# Altium schematic sheet Sheet3_MCU_PSU.SchDoc
size A4; DocumentNumber: 3; SheetNumber: 3; SheetTotal: 3
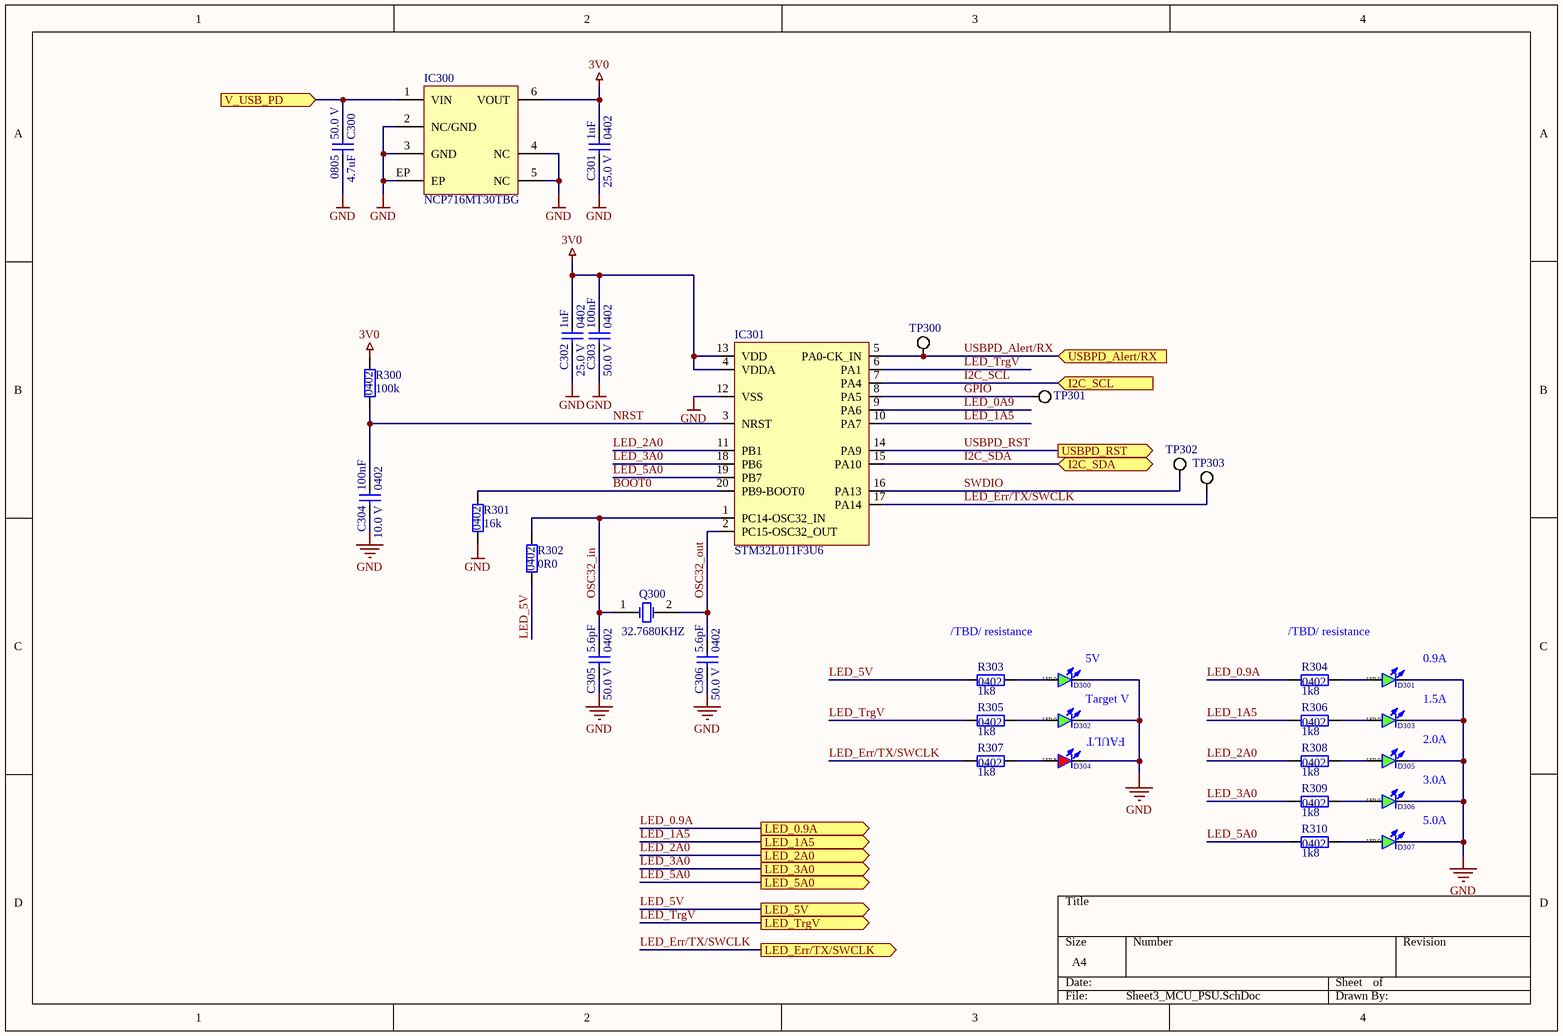
[diagram p0: Sheet3_MCU_PSU.SchDoc]

## Parts
C300  Capacitance: 4.7uF  Footprint: 0805  Voltage: 50.0 V  [C_0805]  (hidden comment: C 4.7uF 0805 50V)
C301  Capacitance: 1uF  Footprint: 0402  Voltage: 25.0 V  [C_0402]  (hidden comment: C 1uF 0402 25V)
C302  Capacitance: 1uF  Footprint: 0402  Voltage: 25.0 V  [C_0402]  (hidden comment: C 1uF 0402 25V)
C303  Capacitance: 100nF  Footprint: 0402  Voltage: 50.0 V  [C_0402]  (hidden comment: C 100nF 0402 50V)
C304  Capacitance: 100nF  Footprint: 0402  Voltage: 10.0 V  [C_0402]  (hidden comment: C 100nF 0402 10V)
C305  Capacitance: 5.6pF  Footprint: 0402  Voltage: 50.0 V  [C_0402]  (hidden comment: C 5.6pF 0402 50V)
C306  Capacitance: 5.6pF  Footprint: 0402  Voltage: 50.0 V  [C_0402]  (hidden comment: C 5.6pF 0402 50V)
D300  LED G  [LED_0603]
D301  LED G  [LED_0603]
D302  LED G  [LED_0603]
D303  LED G  [LED_0603]
D304  LED R  [LED_0603]
D305  LED G  [LED_0603]
D306  LED G  [LED_0603]
D307  LED G  [LED_0603]
IC300  NCP716MT30TBG  [WDFN-6_EP]
IC301  STM32L011F3U6  [UFQFN-20]
Q300  32.7680KHZ  [Q2_3.2x1.5]
R300  Resistance: 100k  Footprint: 0402  [R_0402]  (hidden comment: R 100k 0402)
R301  Resistance: 16k  Footprint: 0402  [R_0402]  (hidden comment: R 16k 0402)
R302  Resistance: 0R0  Footprint: 0402  [R_0402]  (hidden comment: R 0R0 0402)
R303  Resistance: 1k8  Footprint: 0402  [R_0402]  (hidden comment: R 1k8 0402)
R304  Resistance: 1k8  Footprint: 0402  [R_0402]  (hidden comment: R 1k8 0402)
R305  Resistance: 1k8  Footprint: 0402  [R_0402]  (hidden comment: R 1k8 0402)
R306  Resistance: 1k8  Footprint: 0402  [R_0402]  (hidden comment: R 1k8 0402)
R307  Resistance: 1k8  Footprint: 0402  [R_0402]  (hidden comment: R 1k8 0402)
R308  Resistance: 1k8  Footprint: 0402  [R_0402]  (hidden comment: R 1k8 0402)
R309  Resistance: 1k8  Footprint: 0402  [R_0402]  (hidden comment: R 1k8 0402)
R310  Resistance: 1k8  Footprint: 0402  [R_0402]  (hidden comment: R 1k8 0402)
TP300  TP  [TP_1mm]  (value not drawn)  (net tie, no BOM)
TP301  TP  [TP_1mm]  (value not drawn)  (net tie, no BOM)
TP302  TP  [TP_1mm]  (value not drawn)  (net tie, no BOM)
TP303  TP  [TP_1mm]  (value not drawn)  (net tie, no BOM)

## Ports
I2C_SCL (in), I2C_SDA (bidir), LED_0.9A (out), LED_1A5 (out), LED_2A0 (out), LED_3A0 (out), LED_5A0 (out), LED_5V (out), LED_Err/TX/SWCLK (out), LED_TrgV (out), USBPD_Alert/RX (in), USBPD_RST (out), V_USB_PD (in)

## Nets
3V0: C301.2 C302.2 C303.2 IC300.6(VOUT) IC301.4(VDDA) IC301.13(VDD) R300.2
GND: C300.2 C301.1 C302.1 C303.1 C304.1 C305.1 C306.1 D300.K D301.K D302.K D303.K D304.K D305.K D306.K D307.K IC300.2(NC/GND) IC300.3(GND) IC300.4(NC) IC300.5(NC) IC300.EP IC301.12(VSS) R301.1
BOOT0: IC301.20(PB9-BOOT0) R301.2
GPIO: IC301.8(PA5) TP301.1(TP)
I2C_SCL: IC301.7(PA4) ; port I2C_SCL
I2C_SDA: IC301.15(PA10) ; port I2C_SDA
LED_0.9A: R304.2 ; port LED_0.9A
LED_0A9: IC301.9(PA6)
LED_1A5: IC301.10(PA7) R306.2 ; port LED_1A5
LED_2A0: IC301.11(PB1) R308.2 ; port LED_2A0
LED_3A0: IC301.18(PB6) R309.2 ; port LED_3A0
LED_5A0: IC301.19(PB7) R310.2 ; port LED_5A0
LED_5V: R302.1 R303.2 ; port LED_5V
LED_Err/TX/SWCLK: IC301.17(PA14) R307.2 TP303.1(TP) ; port LED_Err/TX/SWCLK
LED_TrgV: IC301.6(PA1) R305.2 ; port LED_TrgV
NRST: C304.2 IC301.3(NRST) R300.1
OSC32_in: C305.2 IC301.1(PC14-OSC32_IN) Q300.1(OSC1) R302.2
OSC32_out: C306.2 IC301.2(PC15-OSC32_OUT) Q300.2(OSC2)
SWDIO: IC301.16(PA13) TP302.1(TP)
USBPD_Alert/RX: IC301.5(PA0-CK_IN) TP300.1(TP) ; port USBPD_Alert/RX
USBPD_RST: IC301.14(PA9) ; port USBPD_RST
V_USB_PD: C300.1 IC300.1(VIN) ; port V_USB_PD
NetD300_A: D300.A R303.1
NetD301_A: D301.A R304.1
NetD302_A: D302.A R305.1
NetD303_A: D303.A R306.1
NetD304_A: D304.A R307.1
NetD305_A: D305.A R308.1
NetD306_A: D306.A R309.1
NetD307_A: D307.A R310.1

## Notes on the sheet
- /TBD/ resistance
- (near D300) 5V
- Target V
- (near D301) 0.9A
- 1.5A
- FAULT
- 2.0A
- 3.0A
- 5.0A

## Library data of the parts
C300 = CAP_4.7uF_50V_0805: CAP CER 4.7UF 50V X5R 0805; Manufacturer: Samsung Electro-Mechanics; Manufacturer Part Number: CL21A475KBQNNNE; Type: Capacitor; Supplier 1: Digi-Key; Supplier Part Number 1: 1276-1248-1-ND
C301 C302 = CAP_1uF_25V_0402: CAP CER 1UF 25V X5R 0402; Manufacturer: Taiyo Yuden; Manufacturer Part Number: TMK105BJ105MV-F; Type: Capacitor; Supplier 1: Digi-Key; Supplier Part Number 1: 587-3245-1-ND
C303 = CAP_100nF_50V_0402: CAP CER 0.1UF 50V X7R 0402; Manufacturer: Murata Electronics; Manufacturer Part Number: GRM155R71H104KE14J; Type: Capacitor; Supplier 1: Digi-Key; Supplier Part Number 1: 490-13342-1-ND
C304 = CAP_100nF_10V_0402: CAP CER 0.1UF 10V X5R 0402; Manufacturer: Samsung Electro-Mechanics; Manufacturer Part Number: CL05A104MP5NNNC; Type: Capacitor; Supplier 1: Digi-Key; Supplier Part Number 1: 1276-1443-1-ND
C305 C306 = CAP_5.6PF_50V_0402: CAP CER 5.6PF 50V C0G/NP0 0402; Manufacturer: Samsung Electro-Mechanics; Manufacturer Part Number: CL05C5R6DB5NNNC; Type: Capacitor; Supplier 1: Digi-Key; Supplier Part Number 1: 1276-1712-1-ND
D300-D303 D305-D307 = D_LED_Green_0603: LED GREEN DIFFUSED 0603 SMD; Manufacturer: OSRAM Opto Semiconductors Inc.; Manufacturer Part Number: LT Q39G-Q1OO-25-1; Type: Diode, LED; Supplier 1: Digi-Key; Supplier Part Number 1: 475-3442-1-ND
D304 = D_LED_Red_0603: LED RED DIFFUSED 0603 SMD; Manufacturer: OSRAM Opto Semiconductors Inc.; Manufacturer Part Number: LS Q976-NR-1; Type: Diode, LED; Supplier 1: Digi-Key; Supplier Part Number 1: 475-2512-1-ND
IC300 = IC_Reg_NCP716MT30TBG: IC REG LINEAR 3V 80MA 6WDFN; Manufacturer: onsemi; Manufacturer Part Number: NCP716MT30TBG; Type: IC, Regulator; Supplier 1: Digi-Key; Supplier Part Number 1: 488-NCP716MT30TBGTR-ND
IC301 = IC_MCU_STM32L011F3U6: IC MCU 32BIT 8KB FLASH 20UFQFPN; Manufacturer: STMicroelectronics; Manufacturer Part Number: STM32L011F3U6TR; Type: IC, MCU; Supplier 1: Digikey; Supplier Part Number 1: 497-18800-2-ND
Q300 = Q_32k768_12p5: CRYSTAL 32.7680KHZ 12.5PF SMD; Manufacturer: NDK America, Inc.; Manufacturer Part Number: NX3215SA-32.768K-EXS00A-MU00003; Type: Other, Crystal; Supplier 1: Digi-Key; Supplier Part Number 1: 644-1313-1-ND
R300 = R_100k_0402: RES 100K OHM 5% 1/16W 0402; Manufacturer: YAGEO; Manufacturer Part Number: RC0402JR-07100KL; Type: Resistor; Supplier 1: Digi-Key; Supplier Part Number 1: 311-100KJRCT-ND
R301 = R_16k_0402: RES 16K OHM 1% 1/16W 0402; Manufacturer: Stackpole Electronics Inc; Manufacturer Part Number: RMCF0402FT16K0; Type: Resistor; Supplier 1: Digi-Key; Supplier Part Number 1: RMCF0402FT16K0CT-ND
R302 = R_0R0_0402: RES 0 OHM JUMPER 1/16W 0402; Manufacturer: Stackpole Electronics Inc; Manufacturer Part Number: RMCF0402ZT0R00; Type: Resistor; Supplier 1: Digi-Key; Supplier Part Number 1: RMCF0402ZT0R00CT-ND
R303-R310 = R_1k8_0402: RES 1.8K OHM 1% 1/16W 0402; Manufacturer: Stackpole Electronics Inc; Manufacturer Part Number: RMCF0402FT1K80; Type: Resistor; Supplier 1: Digi-Key; Supplier Part Number 1: RMCF0402FT1K80CT-ND
TP300-TP303 = TP_1mm: Test Point 1mm